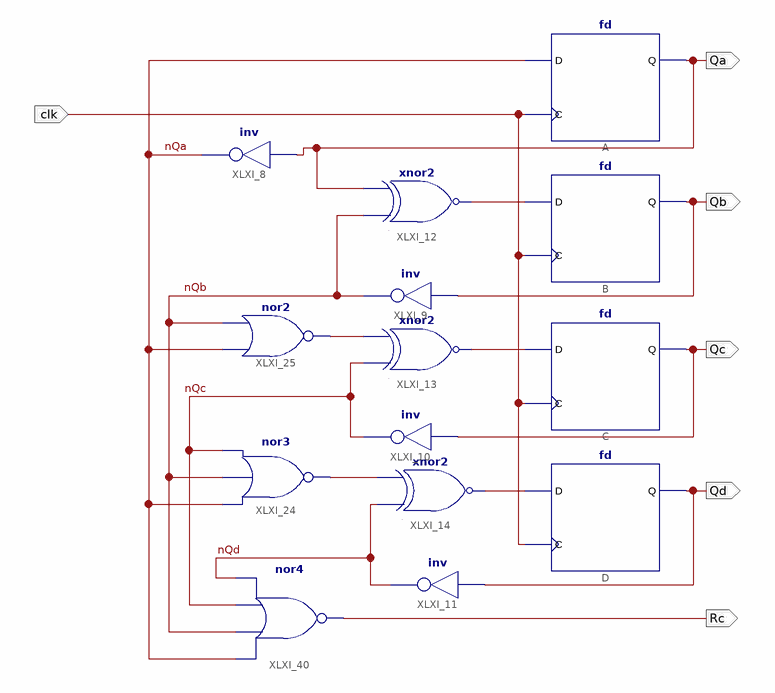
[diagram p0: schematic sheet 1]
// Xilinx ISE schematic Counter_4bit.sch (spartan3) as structural Verilog: 14 symbols, 6 ports
module Counter_4bit (
  input  clk,
  output Qc,
  output Qd,
  output Qb,
  output Rc,
  output Qa
);

  wire nQa, nQb, nQc, nQd, XLXN_10, XLXN_23, XLXN_25, XLXN_183, XLXN_186;

  xnor XLXI_12 (XLXN_10, nQb, Qa);
  fd B (.C(clk), .D(XLXN_10), .Q(Qb));
  xnor XLXI_13 (XLXN_23, nQc, XLXN_186);
  fd C (.C(clk), .D(XLXN_23), .Q(Qc));
  fd D (.C(clk), .D(XLXN_25), .Q(Qd));
  fd A (.C(clk), .D(nQa), .Q(Qa));
  xnor XLXI_14 (XLXN_25, nQd, XLXN_183);
  not XLXI_8 (nQa, Qa);
  not XLXI_11 (nQd, Qd);
  nor XLXI_24 (XLXN_183, nQa, nQb, nQc);
  not XLXI_10 (nQc, Qc);
  nor XLXI_25 (XLXN_186, nQa, nQb);
  not XLXI_9 (nQb, Qb);
  nor XLXI_40 (Rc, nQa, nQb, nQc, nQd);
endmodule
